# EAGLE design simpleUSBamp (EAGLE 7.5.0)
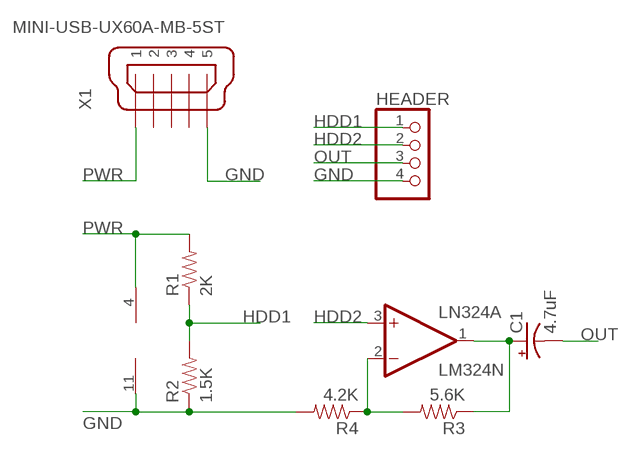
[diagram p0: schematic, sheet 1]

## Parts
C1  4.7uF  CAP_POLPTH1  [CPOL-RADIAL-100UF-25V]
HEADER  PINHD-1X4  [1X04]
LN324  LM324N  [DIL14]
R1  2K  RESISTORPTH-1/4W  [AXIAL-0.4]
R2  1.5K  RESISTORPTH-1/4W  [AXIAL-0.4]
R3  5.6K  RESISTORPTH-1/4W  [AXIAL-0.4]
R4  4.2K  RESISTORPTH-1/4W  [AXIAL-0.4]
X1  MINI-USB-UX60A-MB-5ST  [UX60A-MB-5ST]

## Nets
GND: HEADER.4 LN324.11(P:V-) R2.P$1 R4.P$2 X1.5
HDD1: HEADER.1 R1.P$1 R2.P$2
HDD2: HEADER.2 LN324.3(A:+IN)
N$1: C1.1(+) LN324.1(A:OUT) R3.P$1
N$2: LN324.2(A:-IN) R3.P$2 R4.P$1
OUT: C1.2(-) HEADER.3
PWR: LN324.4(P:V+) R1.P$2 X1.1
Unconnected: LN324.5(B:+IN) LN324.6(B:-IN) LN324.7(B:OUT) LN324.8(C:OUT) LN324.9(C:-IN) LN324.10(C:+IN) LN324.12(D:+IN) LN324.13(D:-IN) LN324.14(D:OUT) X1.2 X1.3 X1.4

## Library data of the parts
C1 = SparkFun-Capacitors:CAP_POL: Capacitor Polarized These are standard SMD and PTH capacitors. Normally 10uF, 47uF, and 100uF in electrolytic and tantalum varieties. Always verify the external diameter of the through hole cap, it varies with capacity, voltage, and manufacturer. The EIA devices should be standard.
HEADER = pinhead:PINHD-1X4: PIN HEADER
LN324 = linear:LM324: OP AMP
R1-R4 = SparkFun-Passives:RESISTOR: Resistor Basic schematic elements and footprints for 0603, 1206, and PTH resistors.
X1 = con-hirose:MINI-USB-: MINI USB Connector Source: http://www.hirose.co.jp/cataloge_hp/e24000019.pdf; OC_FARNELL: unknown; OC_NEWARK: unknown

## Board
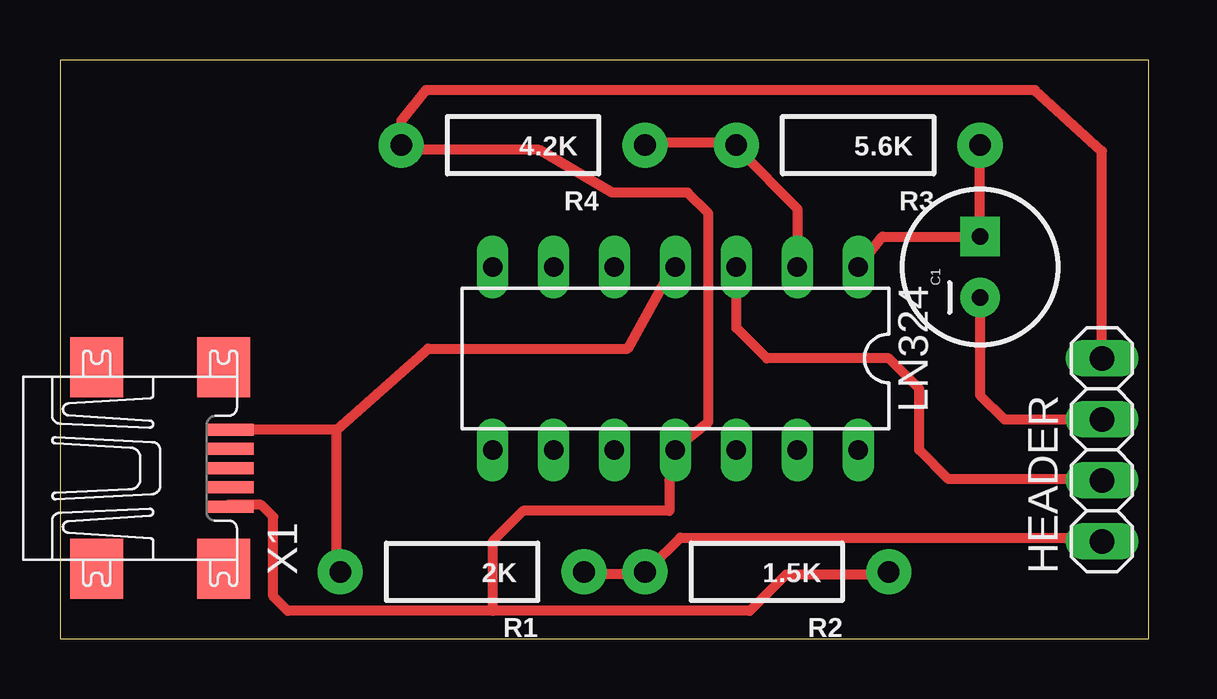
[diagram p1: board, top side]

Size 45.39 x 24.12 mm. Coordinates in mm from the lower left corner, seen from the top.
Outline: 0,0 45.39,0 45.39,24.12 0,24.12 0,0
Copper layers (1*16): Top 0.035mm / dielectric 1.5mm / Bottom 0.035mm
Design rules "default *": minimum track width 16mil, minimum drill 24mil, track to track 8mil, track to pad 8mil, pad to pad 8mil, via to via 8mil, smd to smd 8mil, copper to edge 40mil, drill to drill 8mil, minimum pad ring 10mil, minimum via ring 8mil, stop-mask expansion 4mil, vias tented up to drill 0mil, thermal gap 10mil

### Footprints (pad centres in the part's own frame; a part is rotated, then mirrored left to right if it is on the bottom)
CPOL-RADIAL-100UF-25V = drill 0.7 pad 1.651 square: 1 1.27,0 | drill 0.7 pad 1.651: 2 -1.27,0
1X04 = drill 1.016 long: 1 -3.81,0; 2 -1.27,0; 3 1.27,0; 4 3.81,0
DIL14 = drill 0.813 long: 1 -7.62,-3.81; 2 -5.08,-3.81; 3 -2.54,-3.81; 4 0,-3.81; 5 2.54,-3.81; 6 5.08,-3.81; 7 7.62,-3.81; 8 7.62,3.81; 9 5.08,3.81; 10 2.54,3.81; 11 0,3.81; 12 -2.54,3.81; 13 -5.08,3.81; 14 -7.62,3.81
AXIAL-0.4 = drill 0.9 pad 1.88: P$1 -5.08,0; P$2 5.08,0
UX60A-MB-5ST = smd 2 x 0.5: 1 2.25,1.6; 2 2.25,0.8; 3 2.25,0; 4 2.25,-0.8; 5 2.25,-1.6 | smd 2.2 x 2.5: M1 -3.3,-4.2; M2 -3.3,4.2; M3 2,4.2; M4 2,-4.2

### Placement (x,y rotation side)
C1  38.35,15.49 90 top
HEADER  43.43,7.87 90 top
LN324  25.65,11.68 180 top
R1  16.76,2.79 180 top
R2  29.46,2.79 180 top
R3  33.27,20.57 180 top
R4  19.3,20.57 180 top
X1  4.83,7.11 0 top

### Tracks (layer width: path | path; a pad name or v marks a point on that pad's centre or on a via)
GND
  Top 0.406: 34.7,2.69 R2.P$1 34.39,2.69 30.28,2.69 28.75,1.17 18.03,1.17 | 25.6,7.87 25.55,7.87 25.55,7.21 25.4,6.6 25.4,5.33 19.3,5.33 18.03,4.06 18.03,1.17 | 25.6,7.87 27.03,9.04 27.03,17.73 26.16,18.59 23.01,18.59 19.96,20.37 14.28,20.37 R4.P$2 14.22,21.59 15.24,22.86 40.64,22.86 43.43,20.32 HEADER.4 43.54,11.84 | 25.6,7.87 LN324.11 | 18.03,1.17 9.5,1.17 8.89,1.78 8.89,5.08 8.38,5.59 7,5.59 X1.5
HDD1
  Top 0.406: HEADER.1 43.23,4.22 25.86,4.22 24.64,3 R2.P$2 24.33,2.69 21.89,2.69 R1.P$1
HDD2
  Top 0.406: 28.3,15.49 LN324.3 28.19,12.95 29.46,11.68 34.54,11.68 35.81,10.41 35.81,7.87 37.03,6.66 43.23,6.66 HEADER.2
N$1
  Top 0.406: LN324.1 34.29,16.76 C1.1 R3.P$1
N$2
  Top 0.406: LN324.2 30.73,17.93 28.3,20.37 R3.P$2 27.99,20.68 24.64,20.68 R4.P$1
OUT
  Top 0.406: 43.54,9.09 HEADER.3 39.37,9.14 38.35,10.16 C1.2
PWR
  Top 0.406: R1.P$2 11.53,3 11.53,8.71 | LN324.4 25.55,15.49 23.67,12.09 15.34,12.09 11.53,8.71 | 11.53,8.71 X1.1